# EAGLE design SC182029-V3R0-Servo (EAGLE 9.4.0)
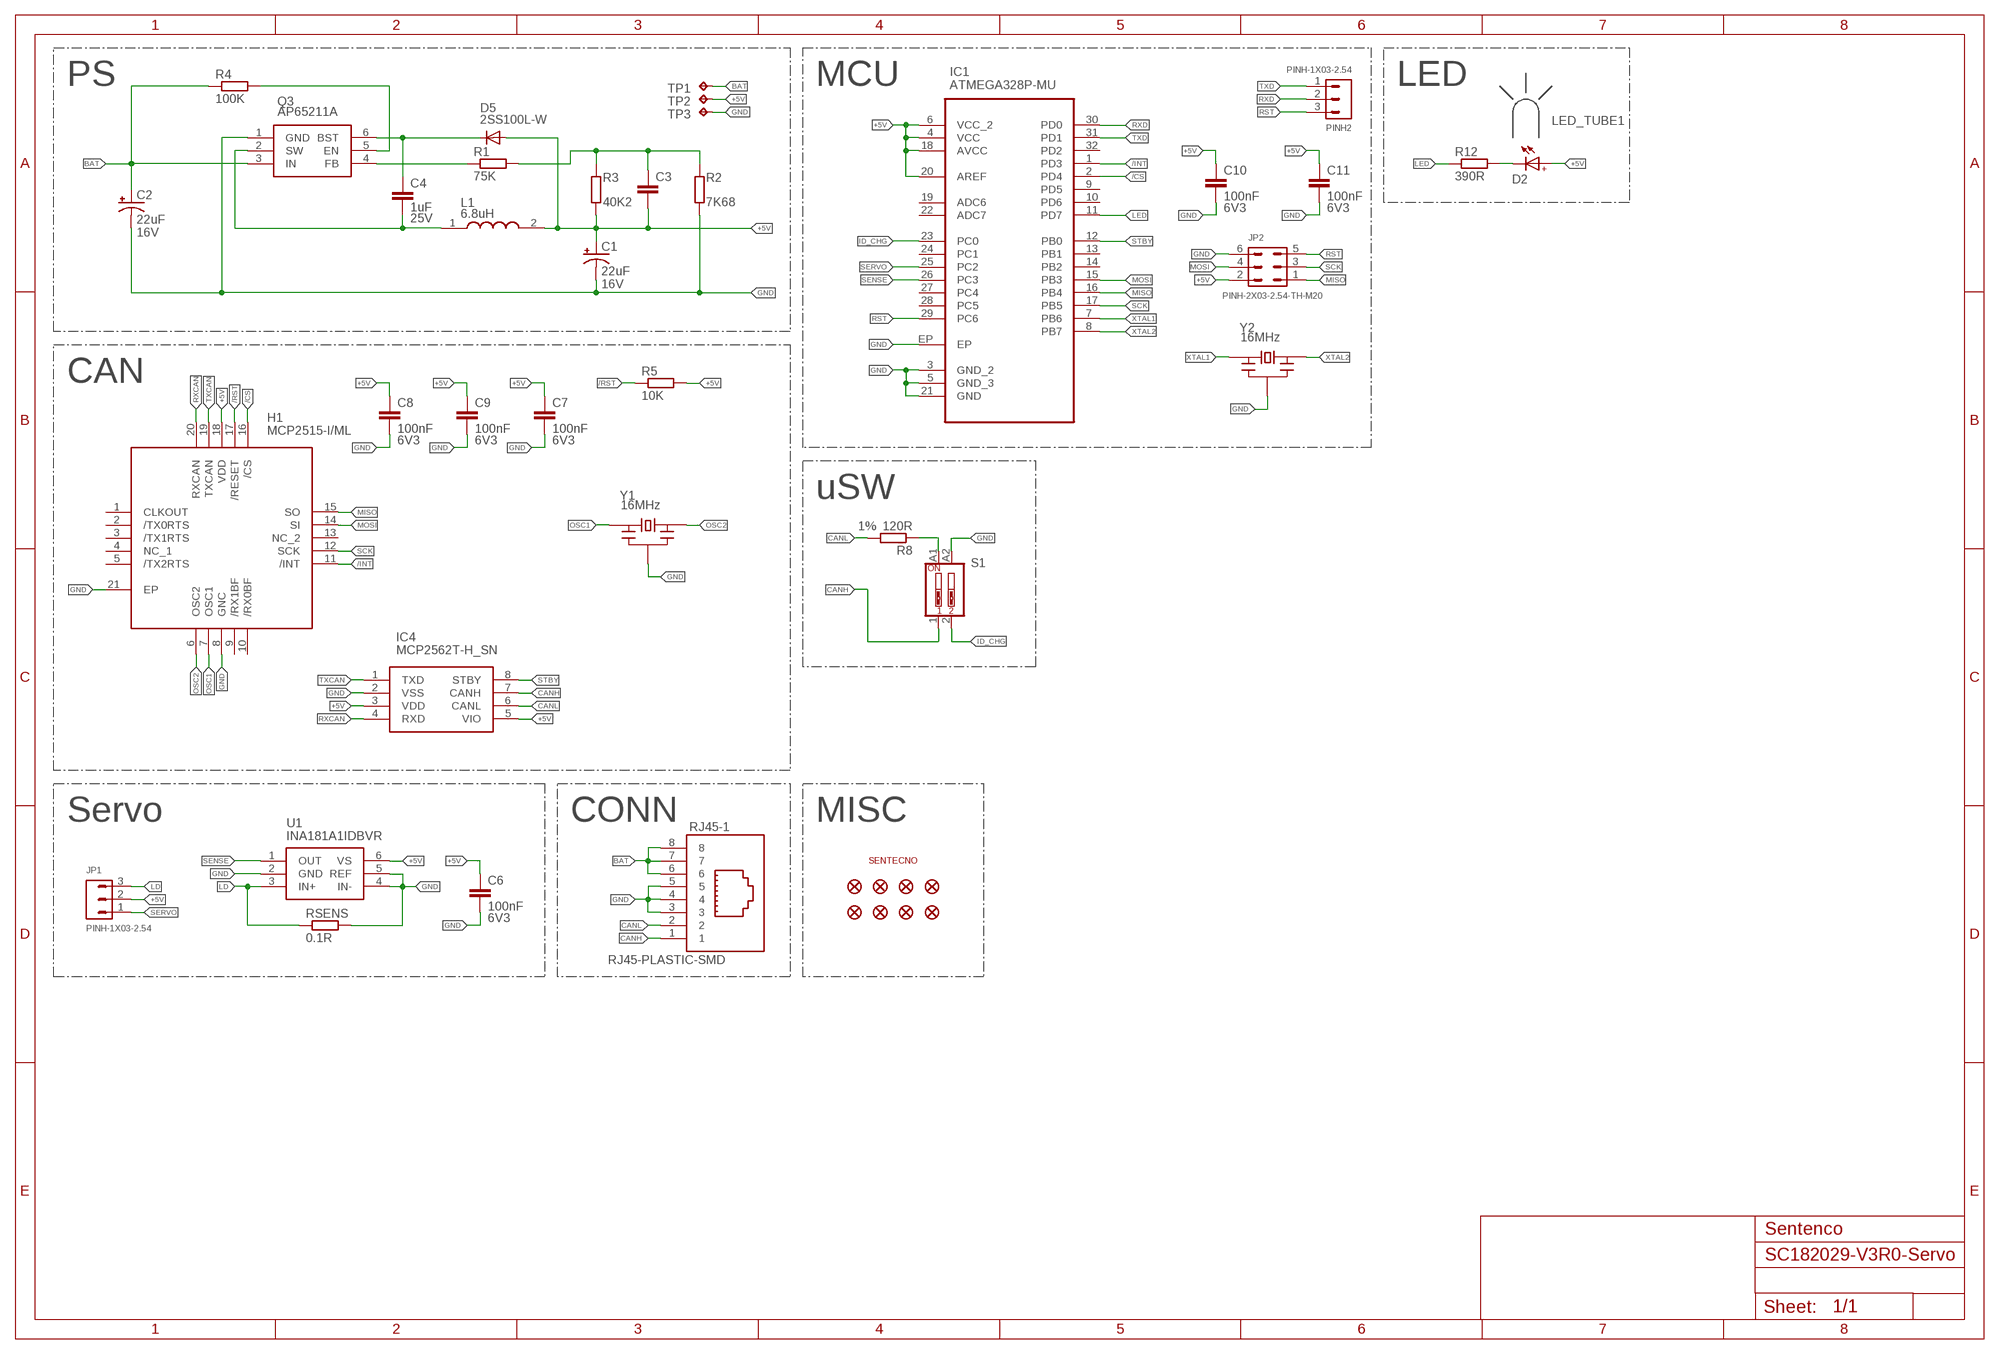
[diagram p0: schematic, sheet 1]

## Parts
C1  22uF  COND_PANASONIC_EEE-B  [B]
C2  22uF  COND_PANASONIC_EEE-B  [B]
C3  COND_CERAMICO_SMD0603R  [C0603R]
C4  1uF  COND_CERAMICO_SMD0603R  [C0603R]
C6  100nF  COND_CERAMICO_SMD0603R  [C0603R]
C7  100nF  COND_CERAMICO_SMD0603R  [C0603R]
C8  100nF  COND_CERAMICO_SMD0603R  [C0603R]
C9  100nF  COND_CERAMICO_SMD0603R  [C0603R]
C10  100nF  COND_CERAMICO_SMD0603R  [C0603R]
C11  100nF  COND_CERAMICO_SMD0603R  [C0603R]
D2  WL-SMCW-150060BS75000  [WL-SMCW_0603]
D5  2SS100L-W  DIODE  [SOD-123FL-CUSTOM]
FID1  FIDUCIALUFIDUCIAL  [MICRO-FIDUCIAL]
FID2  FIDUCIALUFIDUCIAL  [MICRO-FIDUCIAL]
FID3  FIDUCIALUFIDUCIAL  [MICRO-FIDUCIAL]
FID4  FIDUCIALUFIDUCIAL  [MICRO-FIDUCIAL]
FID5  FIDUCIALUFIDUCIAL  [MICRO-FIDUCIAL]
FID6  FIDUCIALUFIDUCIAL  [MICRO-FIDUCIAL]
FID7  FIDUCIALUFIDUCIAL  [MICRO-FIDUCIAL]
FID8  FIDUCIALUFIDUCIAL  [MICRO-FIDUCIAL]
H1  MCP2515-I/ML  [QFN50P400X400X90-21N]
IC1  ATMEGA328P-MU  [QFN50P500X500X100-33N]
IC4  MCP2562T-H_SN  [SOIC127P600X175-8N]
JP1  PINH-1X03-2.54  [PINH-1X03-2.54-1]
JP2  PINH-2X03-2.54-TH-M20  [HDRV6W64P254_2X3_762X508X868P]
L1  6.8uH  NR5040  [NR5040]
LED_TUBE1  LED_TUBEH1  [LED_TUBE_2]
LOGO1  LOGO_SENTECNOLOGO_6X4MM  [LOGO_6X4MM]
PINH2  PINH-1X03-2.54  [PINH-1X03-2.54-1]
Q3  AP65211A  [SOT95P280X90-6N]
R1  75K  RES_CERAMICA_SMD0603R  [R0603R]
R2  7K68  RES_CERAMICA_SMD0603R  [R0603R]
R3  40K2  RES_CERAMICA_SMD0603R  [R0603R]
R4  100K  RES_CERAMICA_SMD0603R  [R0603R]
R5  10K  RES_CERAMICA_SMD0603R  [R0603R]
R8  120R  RES_CERAMICA_SMD0603R  [R0603R]
R12  390R  RES_CERAMICA_SMD0603R  [R0603R]
RJ45-1  RJ45-PLASTIC-SMD  [73304111LF]
RSENS  0.1R  RES_CERAMICA_SMD0603R  [R0603R]
S1  DIP-SW-2  [SMD-DIP-SWITCH-2P]
TP1  TPTP08R  [TP0.8MMR]
TP2  TPTP08R  [TP0.8MMR]
TP3  TPTP08R  [TP0.8MMR]
U1  INA181A1IDBVR  [SOT95P280X145-6N]
Y1  16MHz  RESONADOR_CERAMICO-UNKN1  [CSTNE16M0V530000R0]
Y2  16MHz  RESONADOR_CERAMICO-UNKN1  [CSTNE16M0V530000R0]

## Nets
+5V: C1.PIN_1_POS(+) C3.2 C6.1 C7.1 C8.1 C9.1 C10.1 C11.1 D2.2(+) D5.+(A) H1.18(VDD) IC1.4(VCC) IC1.6(VCC_2) IC1.18(AVCC) IC1.20(AREF) IC4.3(VDD) IC4.5(VIO) JP1.2 JP2.2 L1.2 R3.1 R5.2 TP2.TP U1.6(VS)
/CS: H1.16(/CS) IC1.2(PD4)
/INT: H1.11(/INT) IC1.1(PD3)
/RST: H1.17(/RESET) R5.1
BAT: C2.PIN_1_POS(+) Q3.3(IN) R4.1 RJ45-1.6 RJ45-1.7 RJ45-1.8 TP1.TP
CANH: IC4.7(CANH) RJ45-1.1 S1.1
CANL: IC4.6(CANL) R8.2 RJ45-1.2
GND: C1.PIN_2_NEG(-) C2.PIN_2_NEG(-) C6.2 C7.2 C8.2 C9.2 C10.2 C11.2 H1.8(GNC) H1.21(EP) IC1.3(GND_2) IC1.5(GND_3) IC1.21(GND) IC1.EP IC4.2(VSS) JP2.6 Q3.1(GND) R2.1 RJ45-1.3 RJ45-1.4 RJ45-1.5 RSENS.2 S1.A2 TP3.TP U1.2(GND) U1.4(IN-) U1.5(REF) Y1.2(GND) Y2.2(GND)
ID_CHG: IC1.23(PC0) S1.2
LD: JP1.3 RSENS.1 U1.3(IN+)
LED: IC1.11(PD7) R12.1
MISO: H1.15(SO) IC1.16(PB4) JP2.1
MOSI: H1.14(SI) IC1.15(PB3) JP2.4
N$2: R8.1 S1.A1
N$3: Q3.5(EN) R4.2
N$4: C4.1 D5.-(K) D5.--(K) Q3.6(BST)
N$5: C4.2 L1.1 Q3.2(SW)
N$7: D2.1(-) R12.2
N$10: Q3.4(FB) R1.1
N$11: C3.1 R1.2 R2.2 R3.2
OSC1: H1.7(OSC1) Y1.3(OUT)
OSC2: H1.6(OSC2) Y1.1(IN)
RST: IC1.29(PC6) JP2.5 PINH2.3
RXCAN: H1.20(RXCAN) IC4.4(RXD)
RXD: IC1.30(PD0) PINH2.2
SCK: H1.12(SCK) IC1.17(PB5) JP2.3
SENSE: IC1.26(PC3) U1.1(OUT)
SERVO: IC1.25(PC2) JP1.1
STBY: IC1.12(PB0) IC4.8(STBY)
TXCAN: H1.19(TXCAN) IC4.1(TXD)
TXD: IC1.31(PD1) PINH2.1
XTAL1: IC1.7(PB6) Y2.3(OUT)
XTAL2: IC1.8(PB7) Y2.1(IN)
Unconnected: H1.1(CLKOUT) H1.2(/TX0RTS) H1.3(/TX1RTS) H1.4(NC_1) H1.5(/TX2RTS) H1.9(/RX1BF) H1.10(/RX0BF) H1.13(NC_2) IC1.9(PD5) IC1.10(PD6) IC1.13(PB1) IC1.14(PB2) IC1.19(ADC6) IC1.22(ADC7) IC1.24(PC1) IC1.27(PC4) IC1.28(PC5) IC1.32(PD2)

## Notes on the sheet
- PS | MCU | LED
- CAN
- uSW
- Servo | CONN | MISC
- Sentenco

## Library data of the parts
C1 C2 = sentecno_pasivos:COND_PANASONIC_EEE: Panasonic Aluminum Electrolytic Capacitors Ver footprint para capacidades; MAN1: Illinois Capacitor / CDE; MAN1PN: 226SML016MD4; NOTES: H5.5mm; SENTPN: CESMD-PB-226-16V; VALUE2: 16V
C3 = sentecno_pasivos:COND_CERAMICO_SMD: Condensador ceramico SMD; BLOCK: NM; SENTPN: CCSMD-0603R
C4 = sentecno_pasivos:COND_CERAMICO_SMD: Condensador ceramico SMD; BLOCK: 0; LAYER: Top; MAN1: Taiyo Yuden; MAN1PN: TMK107B7105KA-T; SENTPN: CCSMD-0603-105-25V; VALUE2: 25V
C6-C11 = sentecno_pasivos:COND_CERAMICO_SMD: Condensador ceramico SMD; MAN1: AVX; MAN1PN: 0603YC104KAT2A; SENTPN: CCSMD-0603-104-6V3; VALUE2: 6V3
D2 = sentecno_optoelectronica:WL-SMCW: SMD mono-color Chip LED Characteristics Low energy consumption High reliability Low current requirement Fast switching No UV/IR radiation Smallest SMD package with exceptional brightness Top view Wide viewing angle PBC high-usage Applications Backlight for mobile and portable device keypads Indoor and outdoor message boards Flat backlight for LCDs, switches and symbols Display for industrial control systems and traffic Miniaturized color effects Pedestrian mark Optical indicators General lighting Toys <http://katalog.we-online.de/media/images/v2/Family_WL-SMCW.jpg> Details see: http://katalog.we-online.de/en/led/WL-SMCW?m Updated 2015-04-10 2015 (C) Wurth Elektronik; MAN1: Inolux; MAN1PN: IN-S63AT5G; SENTPN: LEDSMD-0603-GREEN
D5 = sentecno_semiconductores:DIODE: SMT Diode, 2-Pin DO-214AC; BLOCK: NM; LAYER: Top; MAN1: Rectron; MAN1PN: 2SS100L-W; SENTPN: 2SS100L-W
FID1-FID8 = sentecno_misc:FIDUCIAL: Fiducial Alignment Points Various fiducial points for machine vision alignment.
H1 = sentecno_integrados:MCP2515-I/ML: Stand-Alone CAN Controller SPI QFN20 Microchip MCP2515-E/ML, CAN Controller 1MBps CAN 2.0B, 20-Pin QFN Source: Datasheet <https://componentsearchengine.com/Datasheets/2/MCP2515-E_ML.pdf>; MAN1: Microchip; MAN1PN: MCP2515-I/ML; NOTES: H0.9mm; SENTPN: MCP2515-I/ML
IC1 = sentecno_integrados:ATMEGA328P-MU: Programmable Flash; MAN1: Microchip Technology / Atmel; MAN1PN: ATMEGA328P-MU; SENTPN: ATMEGA328P-MU
IC4 = sentecno_integrados:MCP2562T-H_SN: CAN Interface IC Source: Datasheet <https://componentsearchengine.com/Datasheets/1/MCP2562T-H_SN.pdf>; MAN1: Microchip; MAN1PN: MCP2562T-H/SN; NOTES: H1.75mm; SENTPN: MCP2562T-H/SN
JP1 = sentecno_conectores:PINH-1X03; MAN1: Harwin; MAN1PN: M20-9990346; SENTPN: PINH-M-1x03-2.54
JP2 = sentecno_conectores:PINH-2X03; MAN1: Harwin; MAN1PN: M20-9980346; SENTPN: PINH-2X03-2.54
L1 = sentecno_bobinas:NR5040; MAN1: Taiyo Yuden; MAN1PN: NR5040T6R8M; NOTES: H4mm; SENTPN: NR5040T6R8M
LED_TUBE1 = sentecno_optoelectronica:LED_TUBE; MAN1: Bivar; MAN1PN: SLP3-150-150-F; SENTPN: SLP3-150-150-F
LOGO1 = sentecno_misc:LOGO_SENTECNO
PINH2 = sentecno_conectores:PINH-1X03; BLOCK: NM; SENTPN: PINH-M-1x03-2.54
Q3 = sentecno_alimentacion:AP65211A: LIGHT LOAD IMPROVED 1.5A SYNCH DC/DC BUCK CONVERTER TSOT26 Source: Datasheet <https://www.mouser.es/datasheet/2/115/AP65211A-1143084.pdf>; BLOCK: 0; LAYER: Top; MAN1: Diodes Inc.; MAN1PN: AP65211A; SENTPN: AP65211A
R1 = sentecno_pasivos:RES_CERAMICA_SMD: Resistencia ceramica SMD; BLOCK: 0; LAYER: Top; MAN1: Yageo; MAN1PN: RC0603JR-0775KL; SENTPN: RSMD-0603-75K
R2 = sentecno_pasivos:RES_CERAMICA_SMD: Resistencia ceramica SMD; BLOCK: 0; LAYER: Top; MAN1: Bourns; MAN1PN: CR0603-FX-7681ELF; MAN2: RC0603FR-077K68L; MAN2PN: Yageo; SENTPN: RSMD-0603-7K68
R3 = sentecno_pasivos:RES_CERAMICA_SMD: Resistencia ceramica SMD; BLOCK: 0; LAYER: Top; MAN1: Yageo; MAN1PN: RC0603FR-0740K2L; SENTPN: RSMD-0603-40K2
R4 = sentecno_pasivos:RES_CERAMICA_SMD: Resistencia ceramica SMD; BLOCK: 0; LAYER: Top; MAN1: Bourns; MAN1PN: CR0603-JW-104GLF; SENTPN: RSMD-0603-100K
R5 = sentecno_pasivos:RES_CERAMICA_SMD: Resistencia ceramica SMD; MAN1: Bourns; MAN1PN: CR0603-JW-103ELF; SENTPN: RSMD-0603-10K
R8 = sentecno_pasivos:RES_CERAMICA_SMD: Resistencia ceramica SMD; MAN1: Yageo; MAN1PN: RC0603FR-07120RL; SENTPN: RSMD-0603R-120R-10; VALUE2: 1%
R12 = sentecno_pasivos:RES_CERAMICA_SMD: Resistencia ceramica SMD; MAN1: Yageo; MAN1PN: RC0603FR-07390RL; SENTPN: RSMD-0603-390R
RJ45-1 = sentecno_conectores:RJ45-PLASTIC: WR-MJ Horizontal Plastic 8P8C Modular Jack Tab Down, 8 Pins=>Code : Con_I_O_MJ-H_Plastic_Down_615008137121 <http://katalog.we-online.de/media/images/eican/Con_I_O_MJ-H_Plastic_Down_615008137121_pf2.jpg> Details see: http://katalog.we-online.de/en/em/615_008_137_121 Created 2014-07-10, Karrer Zheng 2014 (C) Würth Elektronik; MAN1: Amphenol FCI; MAN1PN: 73304-111LF; NOTES: H14mm; SENTPN: CONSTD-RJ45-SMD-90
RSENS = sentecno_pasivos:RES_CERAMICA_SMD: Resistencia ceramica SMD; MAN1: Yageo; MAN1PN: RL0603JR-070R1L; SENTPN: RSMD-0603-0R1
S1 = sentecno_electromecanicos:DIP-SW-2; MAN1: CTS Electronic Components; MAN1PN: 219-2MST; SENTPN: SWSMD-1x02
TP1-TP3 = sentecno_misc:TP: Test pad
U1 = sentecno_semiconductores:INA181A1IDBVR: Current Sense Amplifiers 26V, Bidirectional, Low- or High-Side Voltage Output Current Sense Amplifier 6-SOT-23 -40 to 125 Source: Datasheet <http://www.ti.com/lit/ds/symlink/ina181.pdf>; MAN1: Texas Instruments; MAN1PN: INA181A1IDBVR; NOTES: H1.45mm; SENTPN: INA181A1IDBVR
Y1 Y2 = sentecno_pasivos:RESONADOR_CERAMICO; MAN1: Murata Electronics; MAN1PN: CSTNE16M0V530000R0; NOTES: H0.9mm; SENTPN: CRES-3.2x1.3-16MHz

## Board
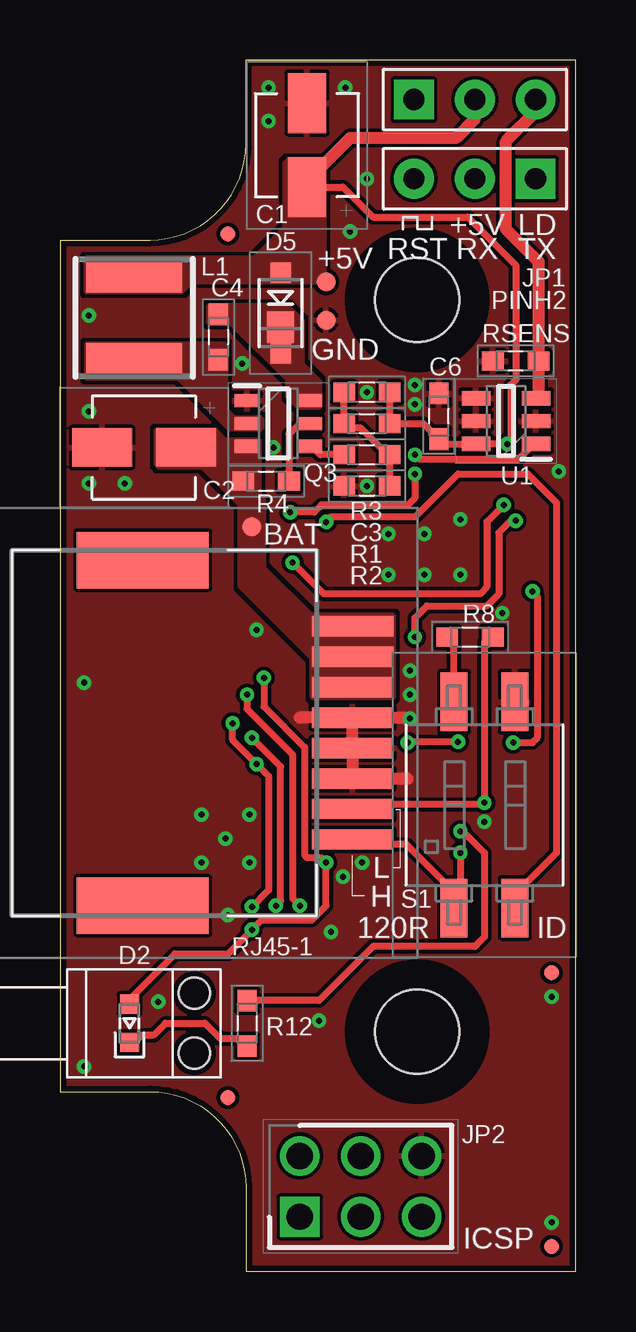
[diagram p1: board, top side]
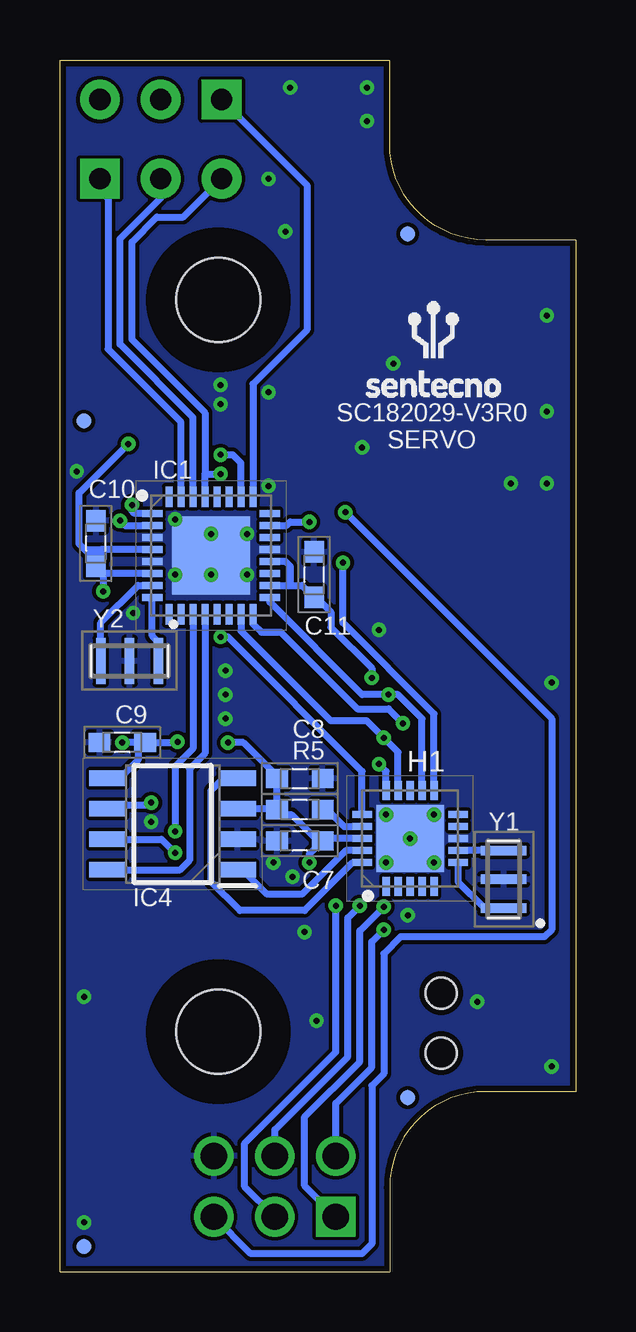
[diagram p2: board, bottom side, seen from below]

Size 21.5 x 50.5 mm. Coordinates in mm from the lower left corner, seen from the top.
Outline: 21.5,0 21.5,50.5 7.75,50.5 7.75,47 arc-90 3.75,43 0,43 0,7.5 3.75,7.5 arc-90 7.75,3.5 7.75,0 21.5,0
Copper layers (1*16): Top 0.018mm / dielectric 1.55mm / Bottom 0.018mm
Design rules "eC_2Layer_PClass6_BaseCopperO18_eCDefault_MOD_DRILL *": minimum track width 0.15mm, minimum drill 0.25mm, track to track 0.15mm, track to pad 0.15mm, pad to pad 0.15mm, via to via 0.15mm, smd to smd 0mil, copper to edge 0.25mm, drill to drill 0.25mm, minimum pad ring 0.175mm, minimum via ring 0.125mm, stop-mask expansion 0mil, vias tented up to drill 0.45mm, thermal gap 0.15mm
Holes 3.51 mm at 14.9,40.5 14.9,10
tRestrict: area 11.9,37.5 to 17.9,43.5; area 11.9,7 to 17.9,13
bRestrict: area 11.9,7 to 17.9,13; area 11.9,37.5 to 17.9,43.5

### Footprints (pad centres in the part's own frame; a part is rotated, then mirrored left to right if it is on the bottom)
B = smd 1.6 x 2.5: PIN_1_POS 0,1.75; PIN_2_NEG 0,-1.75
C0603R = smd 0.9 x 0.8: 1 -0.95,0; 2 0.95,0
WL-SMCW_0603 = smd 0.8 x 0.8: 1 -0.8,0; 2 0.8,0
SOD-123FL-CUSTOM = smd 0.85 x 0.85: + 1.67,0; - -1.68,0 | smd 1.32 x 1.12: -- -0.6,0
MICRO-FIDUCIAL = smd 0.635 x 0.635: 1 0,0
QFN50P400X400X90-21N = smd 0.8 x 0.3: 1 -2,1; 2 -2,0.5; 3 -2,0; 4 -2,-0.5; 5 -2,-1; 11 2,-1; 12 2,-0.5; 13 2,0; 14 2,0.5; 15 2,1 | smd 0.3 x 0.8: 6 -1,-2; 7 -0.5,-2; 8 0,-2; 9 0.5,-2; 10 1,-2; 16 1,2; 17 0.5,2; 18 0,2; 19 -0.5,2; 20 -1,2 | smd 2.8 x 2.8: 21 0,0
QFN50P500X500X100-33N = smd 0.85 x 0.3: 1 -2.45,1.75; 2 -2.45,1.25; 3 -2.45,0.75; 4 -2.45,0.25; 5 -2.45,-0.25; 6 -2.45,-0.75; 7 -2.45,-1.25; 8 -2.45,-1.75; 17 2.45,-1.75; 18 2.45,-1.25; 19 2.45,-0.75; 20 2.45,-0.25; 21 2.45,0.25; 22 2.45,0.75; 23 2.45,1.25; 24 2.45,1.75 | smd 0.3 x 0.85: 9 -1.75,-2.45; 10 -1.25,-2.45; 11 -0.75,-2.45; 12 -0.25,-2.45; 13 0.25,-2.45; 14 0.75,-2.45; 15 1.25,-2.45; 16 1.75,-2.45; 25 1.75,2.45; 26 1.25,2.45; 27 0.75,2.45; 28 0.25,2.45; 29 -0.25,2.45; 30 -0.75,2.45; 31 -1.25,2.45; 32 -1.75,2.45 | smd 3.25 x 3.25: EP 0,0
SOIC127P600X175-8N = smd 1.525 x 0.65: 1 -2.712,1.905; 2 -2.712,0.635; 3 -2.712,-0.635; 4 -2.712,-1.905; 5 2.712,-1.905; 6 2.712,-0.635; 7 2.712,0.635; 8 2.712,1.905
PINH-1X03-2.54-1 = drill 0.889 pad 1.651 square: 1 2.54,0 | drill 0.889 pad 1.651: 2 0,0; 3 -2.54,0
HDRV6W64P254_2X3_762X508X868P = drill 1.1 pad 1.65 square: 1 0,-1.27 | drill 1.1 pad 1.65: 2 0,1.27; 3 2.54,-1.27; 4 2.54,1.27; 5 5.08,-1.27; 6 5.08,1.27
NR5040 = smd 1.5 x 4: 1 -1.8,0; 2 1.8,0
LED_TUBE_2 = hole 1.3: -1.25,2.7; 1.25,2.7
SOT95P280X90-6N = smd 1.05 x 0.55: 1 -1.3,0.95; 2 -1.3,0; 3 -1.3,-0.95; 4 1.3,-0.95; 5 1.3,0; 6 1.3,0.95
R0603R = smd 0.9 x 0.8: 1 -0.95,0; 2 0.95,0
73304111LF = smd 3.4 x 0.84: 1 -7.1,4.445; 2 -7.1,3.175; 3 -7.1,1.905; 4 -7.1,0.635; 5 -7.1,-0.635; 6 -7.1,-1.905; 7 -7.1,-3.175; 8 -7.1,-4.445 | smd 5.5 x 2.35: MP1 1.65,-7.2; MP2 1.65,7.2
SMD-DIP-SWITCH-2P = smd 1.13 x 2.44: 1 -1.27,-4.3; 2 1.27,-4.3; A1 -1.27,4.3; A2 1.27,4.3
TP0.8MMR = smd 0.8 x 0.8: TP 0,0
SOT95P280X145-6N = smd 1.2 x 0.6: 1 -1.25,0.95; 2 -1.25,0; 3 -1.25,-0.95; 4 1.25,-0.95; 5 1.25,0; 6 1.25,0.95
CSTNE16M0V530000R0 = smd 0.4 x 1.9: 1 -1.2,0; 2 0,0; 3 1.2,0

### Placement (x,y rotation side)
C1  10.3,46.95 180 top
C2  3.5,34.35 270 top
C3  12.8,35.35 0 top
C4  6.6,38.95 270 top
C6  15.8,35.65 90 top
C7  11.5,17.95 180 bottom
C8  11.5,20.55 0 bottom
C9  18.9,22.05 180 bottom
C10  20,30.35 90 bottom
C11  10.9,29.05 90 bottom
D2  2.9,10.35 90 top
D5  9.2,39.95 90 top
FID1  20.5,1.05 0 top
FID2  7,43.25 0 top
FID3  20.5,12.45 0 top
FID4  7,7.25 0 top
FID5  7,43.25 0 bottom
FID6  20.5,1.05 0 bottom
FID7  7,7.25 0 bottom
FID8  20.5,35.45 0 bottom
H1  6.9,18.05 90 bottom
IC1  15.2,29.85 0 bottom
IC4  16.8,18.65 180 bottom
JP1  17.3,48.85 180 top
JP2  10,3.55 0 top
L1  3.1,39.75 90 top
LED_TUBE1  2.9,10.35 270 top
LOGO1  6,37.75 0 bottom
PINH2  17.3,45.55 0 top
Q3  9.1,35.35 0 top
R1  12.8,34.05 0 top
R2  12.8,32.75 0 top
R3  12.8,36.65 180 top
R4  8.6,32.95 0 top
R5  11.5,19.25 180 bottom
R8  17.1,26.45 0 top
R12  7.8,10.35 270 top
RJ45-1  5.1,22.45 180 top
RSENS  19,37.95 180 top
S1  17.7,19.45 0 top
TP1  8,31.05 0 top
TP2  11.1,41.25 0 top
TP3  11.1,39.65 0 top
U1  18.6,35.45 180 top
Y1  3,16.35 90 bottom
Y2  18.6,25.45 180 bottom

### Tracks (layer width: path | path; a pad name or v marks a point on that pad's centre or on a via)
+5V  (via drill 0.25 pad 0.6)
  Top 0.3: R3.1 C3.2 15.15,35.35 C6.1 16,34.5 U1.6 v18.65,34.5 18.8,34.65 18.8,36.95 19,37.15 19,41.95 17,43.95 13.05,43.95 11.8,45.2 C1.PIN_1_POS 10.3,45.45 | v16.6,22.08 14.53,22.08 v14.5,22.05 | D2.2 2.9,11.35 4.8,13.25 7,13.25 v8,14.25 8.4,14.65 10.5,14.65 11.1,15.25 v11.1,17.05 10.9,17.25 10.3,17.25 10.2,17.35 10.2,21.85 8.5,23.55 v8.5,24.75 | v18.9,22.05 19.7,22.05 19.9,22.25 19.9,28.15 v19.7,28.35
  Top 0.5: JP1.2 17.3,48.05 16.5,47.25 12.1,47.25 10.3,45.45
  Bottom 0.3: R5.2 12.48,19.29 IC4.3 | H1.18 10.45,18.05 C7.1 | R5.2 C8.1 12.45,20.65 13.85,22.05 v14.5,22.05 | IC4.5 19.01,20.55 18.25,21.32 18.25,21.75 C9.1 | 19.7,29.1 C10.1 19.82,29.57 | IC1.6 19.7,29.1 | IC1.4 19.77,30.1 | IC1.18 11.9,28.6 | 11.9,28.6 11.4,28.6 C11.1 10.8,28.1 10.2,27.5 10.2,26.85 8.5,25.15 v8.5,24.75 | IC1.20 12.1,29.6 11.9,29.4 11.9,28.6 | C7.1 10.75,17.95 11.85,19.05 12.25,19.05 R5.2 | C9.1 v18.9,22.05 | 19.7,29.1 v19.7,28.35 | C9.1 16.63,22.05 v16.6,22.08 | C7.1 11.1,17.4 v11.1,17.05 | JP2.2 10,7.02 8.5,8.52 8.5,13.75 v8,14.25 | 19.82,29.57 19.7,29.7 19.7,30.03 19.77,30.1 | 20.4,30.03 20.37,30 20,30 20,29.75 19.82,29.57 | 20.4,30.03 20.7,30.33 20.7,32.45 v18.65,34.5 | 19.77,30.1 20.4,30.1 20.4,30.03
  pour Top (no thermals): 1,42.25 1.1,42.35 8.1,42.35 9.3,43.55 9.3,46.25 9.5,46.45 11,46.45 11.1,46.35 11.1,41.35 10.9,41.15 5.5,41.15 5.1,40.75 1.1,40.75 1,40.85
/CS  (via drill 0.25 pad 0.6)
  Top 0.3: v14.8,26.45 14.8,27.25 15.3,27.75 17.8,27.75 18.3,28.25 18.3,30.8 18.8,31.3 v19,31.3
  Bottom 0.3: v19,31.3 18.8,31.1 IC1.2 | H1.16 8.9,20.85 14.5,26.45 v14.8,26.45
/INT  (via drill 0.25 pad 0.6)
  Top 0.3: v9.7,29.55 11,28.25 17.52,28.25 17.8,28.53 17.8,31.25 v18.5,31.95
  Bottom 0.3: H1.11 5.9,23.25 9.7,27.05 v9.7,29.55 | IC1.1 18.4,31.6 18.5,31.7 v18.5,31.95
/RST
  Bottom 0.3: R5.1 10.35,19.25 9.65,18.55 H1.17
BAT
  pour Top (no thermals): 10.5,23.85 13.9,23.85 14,23.95 14,27.35 13.9,27.45 10.5,27.45 8.6,29.35 8.6,32.15 8.4,32.35 8.4,34.65 8.3,34.75 6.9,34.75 6.5,35.15 4,35.15 3.9,35.05 3.9,33.65 4.1,33.45 5.9,33.45 7.4,31.95 7.4,28.55 10.4,25.55 10.4,23.95
CANH  (via drill 0.25 pad 0.6)
  Top 0.3: RJ45-1.1 12.4,17.8 14.45,17.8 16.43,15.82 | 16.43,15.82 S1.1 | v16.7,17.45 16.7,16.09 16.43,15.82
  Bottom 0.3: IC4.7 17.27,18.02 v16.7,17.45
CANL  (via drill 0.25 pad 0.6)
  Top 0.3: RJ45-1.2 12.4,19.48 17.62,19.48 v17.7,19.55 17.7,26.25 17.9,26.45 R8.2
  Bottom 0.3: IC4.6 19.35,19.45 17.8,19.45 v17.7,19.55
GND  (via drill 0.25 pad 0.6)
  Top 0.5: RJ45-1.5 14.5,23.09 | RJ45-1.5 10,23.09 | RJ45-1.5 RJ45-1.4 RJ45-1.3 14.5,20.55
  other vias: 11.8,16.45 12.6,17.05 15.2,29.05 16.7,31.35 13.7,29.05 16.7,29.05 11.3,14.15 10.8,10.45 20.5,2.05 20.5,11.45 4.1,11.25 7,14.85 6.9,18.05 5.9,19.05 7.9,19.05 7.9,17.05 5.9,17.05 1,24.55 8.2,26.75 14.6,25.05 14.6,24.05 14.6,23.05 18.45,27.45 17.7,18.75 2.7,32.85 1.2,32.85 1.2,35.85 8.7,49.35 11.9,49.35 8.7,47.95 12.8,45.55 12.1,43.35 7.6,37.85 8.9,34.35 14.8,36.95 20.8,33.35 14.8,36.15 12.8,36.65 12.8,32.75 13.7,30.75 15.2,30.75 1,8.55 1.2,39.85
  pour Top (rank 2): 0,50.5 21.5,50.5 21.5,0 0,0
  pour Bottom (rank 2): 0,50.5 21.5,50.5 21.5,0 0,0
  pour Bottom (no thermals): 12.1,26.75 12.1,32.95 18.3,32.95 18.3,26.75
  pour Bottom (no thermals): 4.3,20.65 9.5,20.65 9.5,15.45 4.3,15.45 4.3,20.55
  pour Bottom (no thermals): 12.1,32.95 18.3,32.95 18.3,26.75 12.1,26.75
ID_CHG  (via drill 0.25 pad 0.6)
  Top 0.3: v11.1,31.25 11.3,31.45 14.8,31.45 16.6,33.25 19.5,33.25 20.7,32.05 20.7,17.45 18.97,15.72 S1.2
  Bottom 0.3: v11.1,31.25 11.9,31.25 12.05,31.1 IC1.23
LD
  Top 0.3: 19.95,36.5 U1.3
  Top 0.5: JP1.3 19.84,48.35 18.6,47.11 18.6,43.45 19.95,42.1 RSENS.1 19.95,36.5
LED  (via drill 0.25 pad 0.6)
  Top 0.3: v16.7,18.35 16.8,18.35 17.7,17.45 17.7,13.95 17.3,13.55 13.05,13.55 10.8,11.3 R12.1
  Bottom 0.3: IC1.11 15.95,21.8 16.7,21.05 v16.7,18.35
MISO  (via drill 0.25 pad 0.6)
  Top 0.3: v7.2,22.85 7.2,22.15 v8.2,21.15 8.7,20.65 8.7,15.9 v8,15.2
  Bottom 0.3: H1.15 7.9,20.85 v8.2,21.15 | IC1.16 13.45,27 13.1,26.65 12.3,26.65 9.1,23.45 7.8,23.45 v7.2,22.85 | JP2.1 11.3,3.58 11.3,6.45 9,8.75 9,14.2 v8,15.2
MOSI  (via drill 0.25 pad 0.6)
  Top 0.3: v9,15.25 9.2,15.45 9.2,21.05 v8,22.25
  Bottom 0.3: H1.14 7.4,21.65 v8,22.25 8.7,22.95 10.2,22.95 13.95,26.7 IC1.15 | JP2.4 12.54,5.91 9.5,8.95 9.5,14.75 v9,15.25
N$2
  Top 0.3: R8.1 16.43,26.17 S1.A1
N$3
  Top 0.3: Q3.5 10,35.35 9.55,34.9 R4.2
N$4
  pour Top (no thermals): 6.2,39.45 7.1,39.45 9.4,37.15 9.4,36.45 9.9,35.95 10.85,35.95 10.93,36.03 10.93,37.12 10.2,37.85 10.2,39.65 9.5,40.35 6.2,40.35 6.1,40.25 6.1,39.55
N$5
  pour Top (no thermals): 1.1,38.75 1,38.65 1,37.25 1.1,37.15 4.9,37.15 7,35.05 8.4,35.05 8.5,35.15 8.5,35.55 8.4,35.65 7.3,35.65 7,35.95 7,38.65 6.9,38.75
N$7
  Top 0.3: D2.1 3.1,9.55 3.4,9.85 3.9,9.85 4.4,10.35 6.05,10.35 6.7,9.7 7.7,9.7 7.8,9.6 R12.2
N$10
  Top 0.3: R1.1 10.85,34.05 10.5,34.4 Q3.4
N$11
  Top 0.3: R2.2 R1.2 13.65,34.05 12.55,35.15 12.05,35.15 C3.1 R3.2
OSC1
  Bottom 0.3: Y1.3 H1.7
OSC2
  Bottom 0.3: H1.6 4.9,16.25 3.8,15.15 Y1.1
RST  (via drill 0.25 pad 0.6)
  Top 0.3: v14.8,33.25 14.8,32.25 14.5,31.95 10.9,31.95 10.6,31.65 v9.6,31.65
  Bottom 0.3: PINH2.3 16.36,43.95 17.46,43.95 18.5,42.91 18.5,38.85 15.45,35.8 15.45,33.25 | IC1.29 15.45,33.25 | 15.45,33.25 v14.8,33.25 | v9.6,31.65 1,23.05 1,14.25 1.3,13.95 7.3,13.95 8,13.25 8,8.25 8.5,7.75 8.5,1.15 8.9,0.75 13.55,0.75 JP2.5
RXCAN
  Bottom 0.3: H1.20 9.3,17.05 11.3,15.05 14,15.05 15.2,16.25 15.2,20.05 14.7,20.55 IC4.4
RXD
  Bottom 0.3: PINH2.2 17.3,44.75 19,43.05 19,38.65 15.95,35.6 IC1.30
SCK  (via drill 0.25 pad 0.6)
  Top 0.3: v10,15.25 9.7,15.55 9.7,21.55 7.8,23.45 v7.8,24.05
  Bottom 0.3: H1.12 6.4,23.05 7.4,24.05 v7.8,24.05 8.9,24.05 12.75,27.9 IC1.17 | JP2.3 13.8,3.54 13.8,5.35 10,9.15 v10,15.25
SENSE  (via drill 0.25 pad 0.6)
  Top 0.3: U1.1 19.75,34.5 19.1,33.85 15,33.85 v14.8,34.05
  Bottom 0.3: IC1.26 13.95,33.7 14.3,34.05 v14.8,34.05
SERVO
  Bottom 0.3: JP1.1 11.2,45.29 11.2,39.25 13.45,37 IC1.25
STBY
  Bottom 0.3: IC4.8 16.5,16.75 16.1,17.14 16.1,20.95 15.45,21.6 IC1.12
TXCAN
  Bottom 0.3: H1.19 9.58,17.55 11.38,15.74 12.89,15.74 13.89,16.75 IC4.1
TXD
  Bottom 0.3: IC1.31 16.45,35.4 19.5,38.45 19.5,44.71 19.84,45.05 PINH2.1
XTAL1
  Bottom 0.3: Y2.3 19.8,27.05 18.25,28.6 IC1.7
XTAL2
  Bottom 0.3: Y2.1 17.4,26.25 17.65,26.5 IC1.8

### Text on the board
tPlace: +5V | LD | RST | RX | TX | +5V | GND | BAT | L | H | 120R | ID | ICSP
bPlace: SC182029-V3R0 / SERVO
Reference: Eje Servo
200bmp: Cable de acero
201bmp: Servo
202bmp: Rodamiento
203bmp: Pieza 3D
204bmp: Funda Cable
208bmp: Pieza 3D que se desliza